# EAGLE schematic module_i2c (EAGLE 7.4.0)
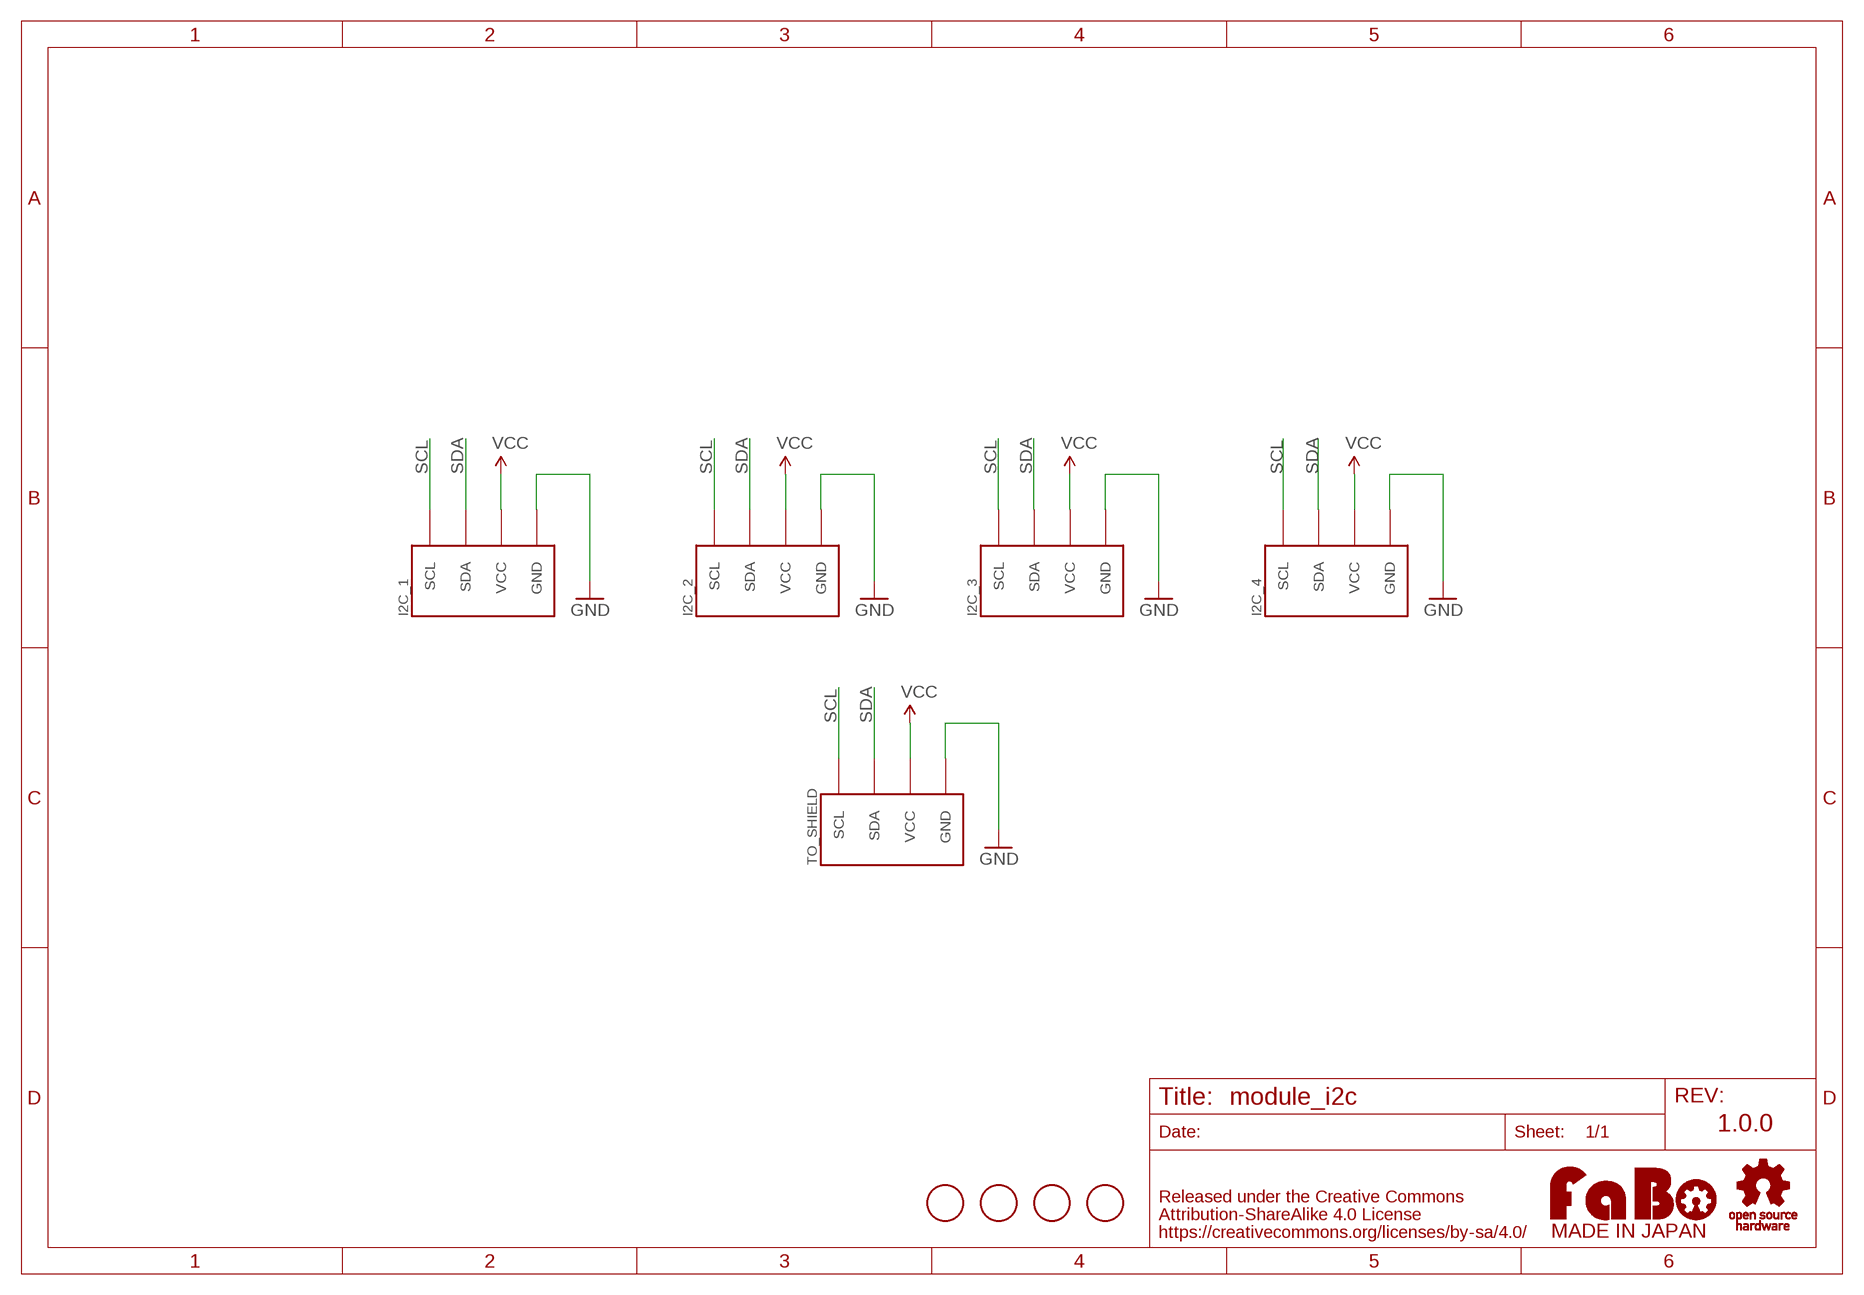
[diagram p0: schematic, sheet 1]

## Parts
I2C_1  FABO_BRICK_I2C-CONNECTOR  [FABO_BRICK_I2C_CONNECTOR]
I2C_2  FABO_BRICK_I2C-CONNECTOR  [FABO_BRICK_I2C_CONNECTOR]
I2C_3  FABO_BRICK_I2C-CONNECTOR  [FABO_BRICK_I2C_CONNECTOR]
I2C_4  FABO_BRICK_I2C-CONNECTOR  [FABO_BRICK_I2C_CONNECTOR]
TO_SHIELD  FABO_BRICK_I2C-CONNECTOR  [FABO_BRICK_I2C_CONNECTOR]
U$7  SCREW-PAD-3MM  [SCREWPAD_3MM]
U$8  SCREW-PAD-3MM  [SCREWPAD_3MM]
U$9  SCREW-PAD-3MM  [SCREWPAD_3MM]
U$10  SCREW-PAD-3MM  [SCREWPAD_3MM]
U$11  LOGO_OSHW-T_M  [LOGO_OSHW_T_M]
U$12  LOGO_FABO-M  [LOGO_FABO_M]

## Nets
GND: I2C_1.GND I2C_2.GND I2C_3.GND I2C_4.GND TO_SHIELD.GND
SCL: I2C_1.SCL I2C_2.SCL I2C_3.SCL I2C_4.SCL TO_SHIELD.SCL
SDA: I2C_1.SDA I2C_2.SDA I2C_3.SDA I2C_4.SDA TO_SHIELD.SDA
VCC: I2C_1.VCC I2C_2.VCC I2C_3.VCC I2C_4.VCC TO_SHIELD.VCC

## Notes on the sheet
- 1.0.0

## Library data of the parts
I2C_1-I2C_4 TO_SHIELD = FaBo-Template:FABO_BRICK_I2C: FaBo Brick I2C
U$7-U$10 = gclue:SCREW-PAD
U$11 = FaBo-etc:LOGO_OSHW
U$12 = FaBo-etc:LOGO_FABO